# EAGLE design PWM (EAGLE 7.5.0)
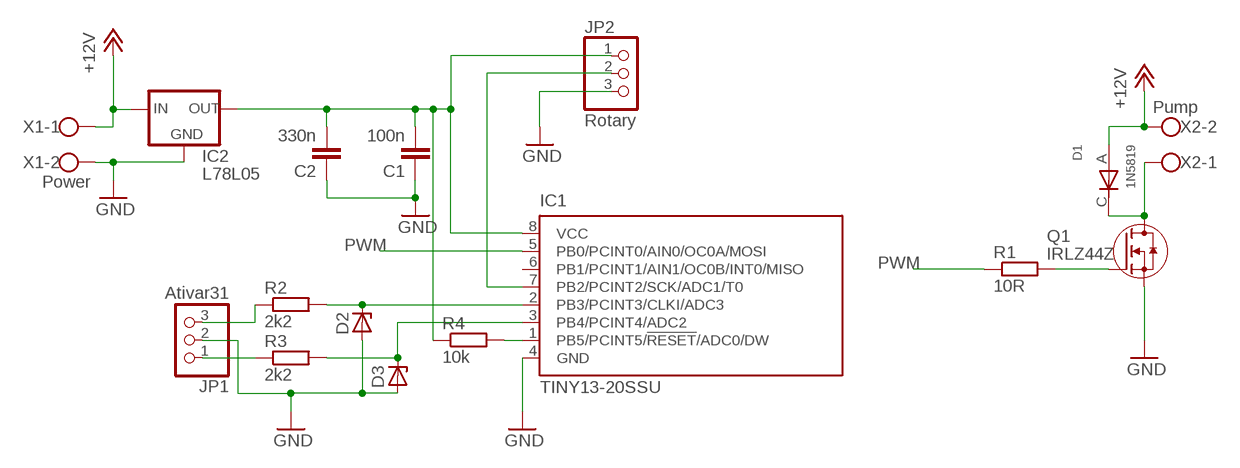
[diagram p0: schematic, sheet 1]

## Parts
C1  100n  C-EUC0805  [C0805]
C2  330n  C-EUC0805  [C0805]
D1  1N5819  DIODESMD  [DO214AC]
D2  ZENER-DIODESOD80C  [SOD80C]
D3  ZENER-DIODESOD80C  [SOD80C]
IC1  TINY13-20SSU  [8S1]
IC2  L78L05  78LXX  [78LXX]
JP1  Ativar31  PINHD-1X3  [1X03]
JP2  Rotary  PINHD-1X3  [1X03]
Q1  IRLZ44Z  [TO220AV]
R1  10R  R-EU_R0805  [R0805]
R2  2k2  R-EU_R0805  [R0805]
R3  2k2  R-EU_R0805  [R0805]
R4  10k  R-EU_R0805  [R0805]
X1  Power  W237-102  [W237-102]
X2  Pump  W237-102  [W237-102]

## Nets
+12V: D1.A(ANOD) IC2.IN X1.1 X2.2
GND: C1.1 C2.1 D2.A D3.A IC1.4(GND) IC2.GND JP1.2 JP2.3 Q1.3(S) X1.2
N$1: C1.2 C2.2 IC1.8(VCC) IC2.OUT JP2.1 R4.1
N$2: D1.C(KATOD) Q1.2(D) X2.1
N$3: Q1.1(G) R1.2
N$4: JP1.3 R2.1
N$5: JP1.1 R3.1
N$6: D2.C IC1.2(PB3/PCINT3/CLKI/ADC3) R2.2
N$7: D3.C IC1.3(PB4/PCINT4/ADC2) R3.2
N$11: IC1.1(PB5/PCINT5/!RESET!/ADC0/DW) R4.2
N$12: IC1.7(PB2/PCINT2/SCK/ADC1/T0) JP2.2
PWM: IC1.5(PB0/PCINT0/AIN0/OC0A/MOSI) R1.1
Unconnected: IC1.6(PB1/PCINT1/AIN1/OC0B/INT0/MISO)

## Library data of the parts
C1 C2 = rcl:C-EU: CAPACITOR, European symbol
D1 = usb:DIODE: DIODE
D2 D3 = diode:ZENER-DIODE: Z-Diode
IC1 = atmel:TINY13: 8-bit AVR Microcontroller with 1K Bytes In-System Programmable Flash Source: http://www.atmel.com/dyn/resources/prod_documents/2535S.pdf; MPN: ATTINY13-20SSU; OC_FARNELL: 1455133; OC_NEWARK: 58M3771
IC2 = v-reg:78LXX: VOLTAGE REGULATOR
JP1 JP2 = pinhead:PINHD-1X3: PIN HEADER
Q1 = usb:IRLZ44Z
R1-R4 = rcl:R-EU_: RESISTOR, European symbol
X1 X2 = con-wago-500:W237-102: WAGO SCREW CLAMP; MPN: 237-102; OC_FARNELL: unknown; OC_NEWARK: 70K9898

## Board
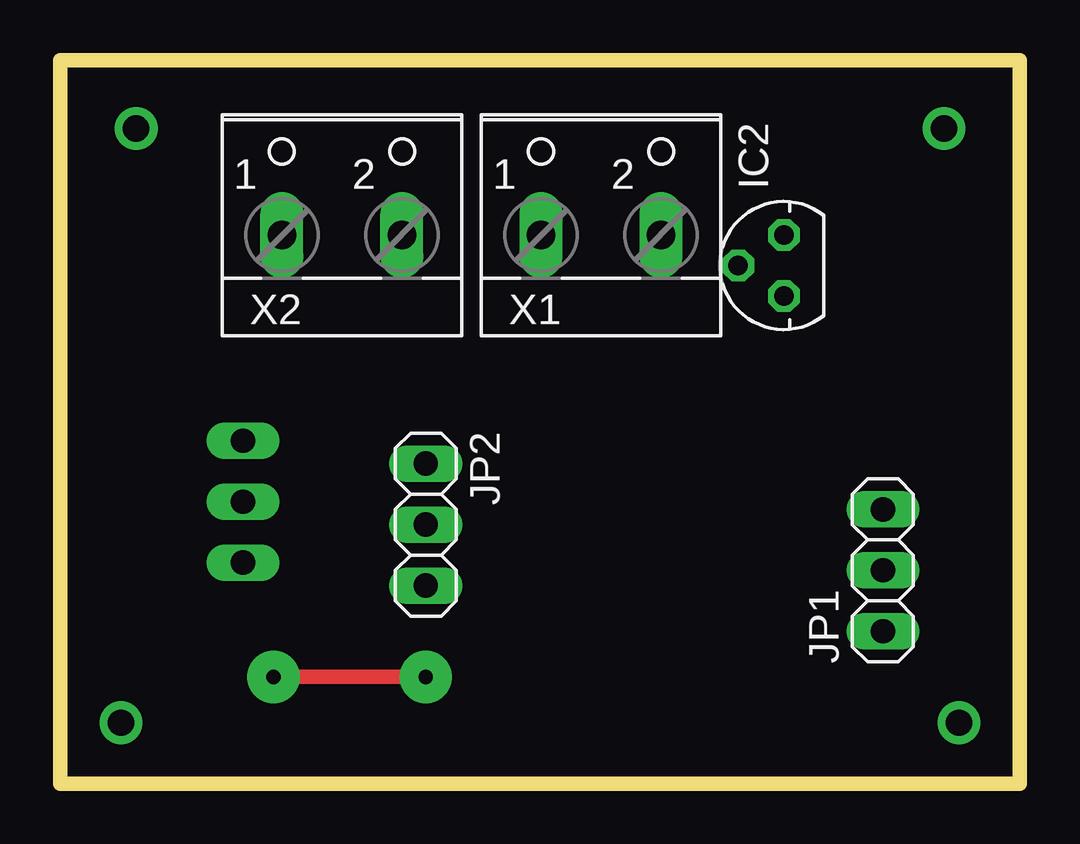
[diagram p1: board, top side]
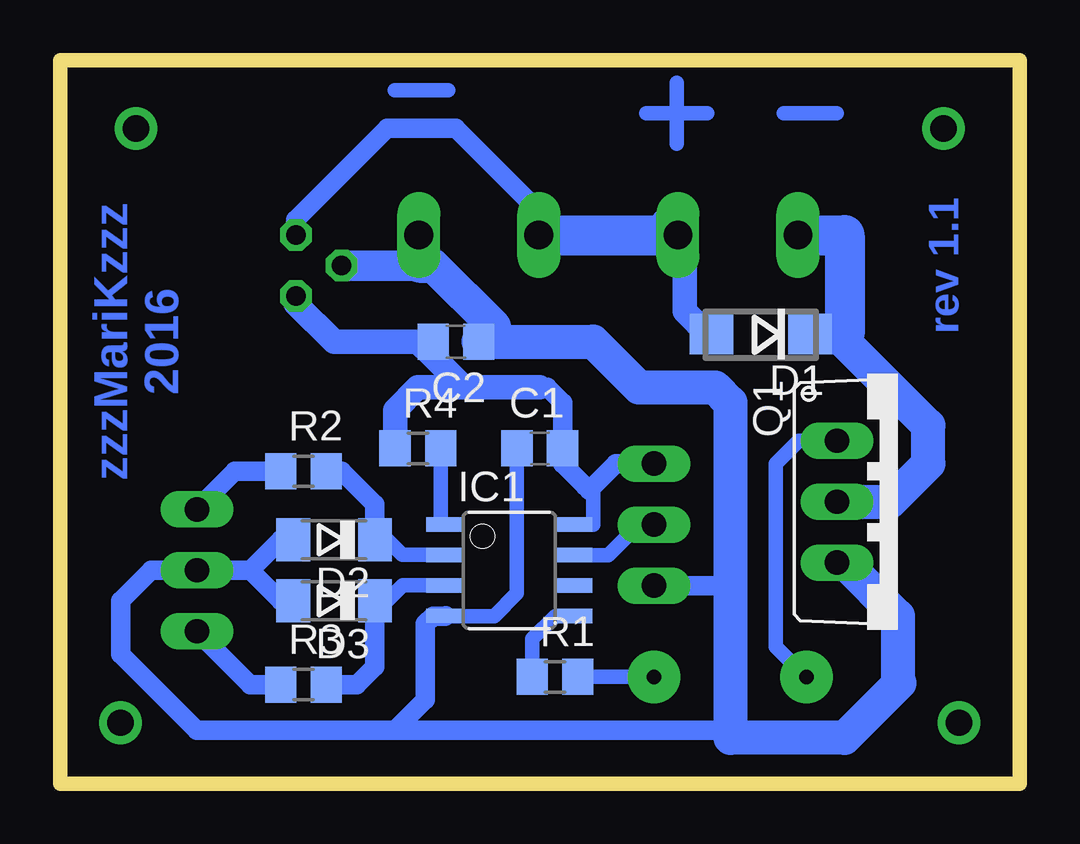
[diagram p2: board, bottom side, seen from below]

Size 39.99 x 30.15 mm. Coordinates in mm from the lower left corner, seen from the top.
Outline: 0,0 39.99,0 39.99,30.15 0,30.15 0,0
Copper layers (1*16): Top 0.035mm / dielectric 1.5mm / Bottom 0.035mm
Design rules "default": minimum track width 10mil, minimum drill 24mil, track to track 8mil, track to pad 8mil, pad to pad 8mil, via to via 8mil, smd to smd 8mil, copper to edge 40mil, drill to drill 8mil, minimum pad ring 10mil, minimum via ring 8mil, stop-mask expansion 4mil, vias tented up to drill 0mil, thermal gap 10mil

### Footprints (pad centres in the part's own frame; a part is rotated, then mirrored left to right if it is on the bottom)
C0805 = smd 1.3 x 1.5: 1 -0.95,0; 2 0.95,0
DO214AC = smd 1.8 x 1.7: A 2.05,0; C -2.05,0
SOD80C = smd 1.4 x 1.8: A 1.7,0; C -1.7,0
8S1 = smd 0.6 x 1.6: 1 -1.905,-2.654; 2 -0.645,-2.654; 3 0.625,-2.654; 4 1.895,-2.654; 5 1.905,2.654; 6 0.635,2.654; 7 -0.635,2.654; 8 -1.905,2.654
78LXX = drill 0.813 octagon: GND 0,1.905; IN 1.27,0; OUT -1.27,0
1X03 = drill 1.016 long: 1 -2.54,0; 2 0,0; 3 2.54,0
TO220AV = drill 1.016 long: 1 -2.54,-2.54; 2 0,-2.54; 3 2.54,-2.54
R0805 = smd 1.3 x 1.5: 1 -0.95,0; 2 0.95,0
W237-102 = drill 1.194 long: 1 -2.5,-1.27; 2 2.5,-1.27

### Placement (x,y rotation side)
C1  20,13.97 0 bottom
C2  23.5,18.41 180 bottom
D1  10.79,18.73 180 bottom
D2  28.57,10.16 180 bottom
D3  28.57,7.62 180 bottom
IC1  21.27,8.89 270 bottom
IC2  30.16,21.59 90 top
JP1  34.29,8.89 90 top
JP2  15.24,10.79 270 top
Q1  5.08,11.75 270 bottom
R1  19.37,4.45 0 bottom
R2  29.84,13.02 0 bottom
R3  29.84,4.13 0 bottom
R4  25.08,13.97 0 bottom
X1  22.54,24.13 0 top
X2  11.75,24.13 0 top

### Tracks (layer width: path | path; a pad name or v marks a point on that pad's centre or on a via)
+12V
  Bottom 0.813: IC2.IN 30.16,23.5 26.35,27.3 23.5,27.3 20.32,24.13 20.32,23.14 X1.1 | 14.92,23.5 14.29,22.86
  Bottom 1.016: D1.A 13.02,18.73 13.97,19.68 13.97,22.58 X2.2
  Bottom 1.676: X1.1 14.29,22.86 X2.2
GND
  Bottom 0.61: C1.1 20.95,7.94 21.91,6.99 23.92,6.99 IC1.4
  Bottom 0.813: D2.A 30.8,10.16 32.07,8.89 | 32.07,8.89 JP1.2 36.2,8.89 37.47,7.62 37.47,5.4 34.29,2.22 26.04,2.22 | D3.A 30.8,7.62 32.07,8.89 | 26.04,2.22 24.77,3.49 24.77,6.67 24.45,6.99 23.94,6.99 IC1.4 | 26.04,2.22 12.38,2.22 12.06,1.91 | JP2.3 12.38,8.26 12.06,7.94 | C2.1 22.54,19.05 21.91,19.05
  Bottom 1.27: IC2.GND 25.04,21.59 X1.2
  Bottom 1.422: 25.04,21.59 24.45,21.59 21.91,19.05 | 5.02,4.18 5.08,4.13 | C2.1 17.78,18.41 15.88,16.51 12.7,16.51 12.06,15.88 12.06,7.94 12.06,1.91 7.3,1.91 5.24,3.97 5.08,4.13 | Q1.3 7.3,9.21 5.08,6.99 5.08,4.13
N$1
  Bottom 0.61: IC1.8 17.78,10.79 17.78,12.06 17.94,12.22 18.1,12.38
  Bottom 0.813: 20,16.51 19.68,16.51 19.05,15.88 C1.2 | C1.2 | C1.2 19.05,13.34 18.1,12.38 | JP2.1 16.83,13.34 17.94,12.22 | C2.2 24.45,17.78
  Bottom 1.016: R4.1 26.03,15.56 25.08,16.51 23.18,16.51 | 23.18,16.51 20,16.51 | IC2.OUT 30.16,20 28.57,18.41 25.08,18.41 24.45,17.78 23.18,16.51
N$2
  Bottom 1.422: Q1.2 5.4,11.75 3.81,13.34 3.81,14.92 7.62,18.73
  Bottom 1.676: X2.1 7.3,22.86 7.3,18.73 7.62,18.73 D1.C
N$3  (via drill 0.6 pad 2.18)
  Top 0.61: v8.89,4.45 v15.24,4.45
  Bottom 0.61: Q1.1 9.21,14.29 10.16,13.34 10.16,5.71 v8.89,4.45 | v15.24,4.45 R1.2
N$4
  Bottom 0.813: R2.1 32.7,13.02 JP1.3
N$5
  Bottom 0.813: R3.1 32.07,4.13 JP1.1
N$6
  Bottom 0.61: IC1.2 25.73,9.54 26.35,10.16 D2.C
  Bottom 0.813: D2.C 26.88,11.63 28.26,13.02 R2.2
N$7
  Bottom 0.61: IC1.3 25.71,8.27 26.35,7.62 D3.C
  Bottom 0.813: D3.C 26.88,4.88 27.62,4.13 R3.2
N$8
  Bottom 0.61: 7.62,27.94 9.84,27.94
N$9
  Bottom 0.61: 13.02,27.94 15.56,27.94
N$10
  Bottom 0.61: 14.29,29.21 14.29,26.67
N$11
  Bottom 0.61: R4.2 24.13,11 IC1.1
N$12
  Bottom 0.61: IC1.7 17.14,9.53 15.88,10.79 JP2.2
N$13
  Bottom 0.61: 26.04,28.89 23.81,28.89
N$14  (via drill 1.1 pad 1.78)
  other vias: 3.17,27.3
N$15  (via drill 1.1 pad 1.78)
  other vias: 36.83,27.3
N$16  (via drill 1.1 pad 1.78)
  other vias: 37.47,2.54
N$17  (via drill 1.1 pad 1.78)
  other vias: 2.54,2.54
PWM
  Bottom 0.61: IC1.5 19.37,6.99 20.32,6.03 R1.1

### Text on the board
Bottom: rev 1.1 | zzzMariKzzz / 2016